# Altium schematic sheet MGNGSQ4_Extender.SchDoc
size A
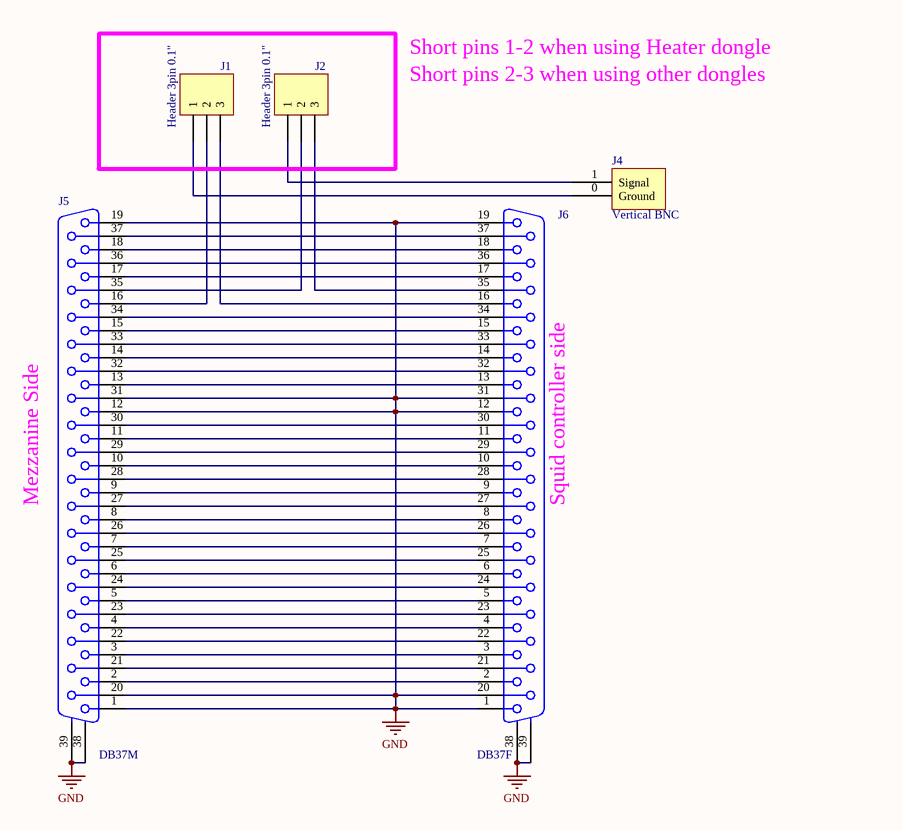
[diagram p0: MGNGSQ4_Extender.SchDoc]

## Parts
J1  Header 3pin 0.1"  [HDR1X3]
J2  Header 3pin 0.1"  [HDR1X3]
J4  Vertical BNC  [BNCVert]
J5  DB37M  [DSUB37-M]
J6  DB37F  [DSUB37-F]

## Nets
GND: J5.1 J5.12 J5.19 J5.20 J5.31 J5.38(MH1) J5.39(MH2) J6.1 J6.12 J6.19 J6.20 J6.31 J6.38(MH1) J6.39(MH2)
NetJ1_1: J1.1 J4.0(Ground)
NetJ1_2: J1.2 J5.16
NetJ1_3: J1.3 J6.16
NetJ2_1: J2.1 J4.1(Signal)
NetJ2_2: J2.2 J5.35
NetJ2_3: J2.3 J6.35
NetJ5_2: J5.2 J6.2
NetJ5_3: J5.3 J6.3
NetJ5_4: J5.4 J6.4
NetJ5_5: J5.5 J6.5
NetJ5_6: J5.6 J6.6
NetJ5_7: J5.7 J6.7
NetJ5_8: J5.8 J6.8
NetJ5_9: J5.9 J6.9
NetJ5_10: J5.10 J6.10
NetJ5_11: J5.11 J6.11
NetJ5_13: J5.13 J6.13
NetJ5_14: J5.14 J6.14
NetJ5_15: J5.15 J6.15
NetJ5_17: J5.17 J6.17
NetJ5_18: J5.18 J6.18
NetJ5_21: J5.21 J6.21
NetJ5_22: J5.22 J6.22
NetJ5_23: J5.23 J6.23
NetJ5_24: J5.24 J6.24
NetJ5_25: J5.25 J6.25
NetJ5_26: J5.26 J6.26
NetJ5_27: J5.27 J6.27
NetJ5_28: J5.28 J6.28
NetJ5_29: J5.29 J6.29
NetJ5_30: J5.30 J6.30
NetJ5_32: J5.32 J6.32
NetJ5_33: J5.33 J6.33
NetJ5_34: J5.34 J6.34
NetJ5_36: J5.36 J6.36
NetJ5_37: J5.37 J6.37

## Notes on the sheet
- Short pins 1-2 when using Heater dongle
- Short pins 2-3 when using other dongles
- (near J5) Mezzanine Side
- (near J6) Squid controller side

## Library data of the parts
J1 J2 = Header3: Header, 0.1", 3-Pin straight; Manufacturer: Digikey; Footprint: *
J4 = BNCVertical
J5 = DB37M: Assembly Comments: none; Manufacturers Part Number: DB37M; Type: Connector; SupplierUnitCost: $3.35
J6 = DB37F: Assembly Comments: none; Manufacturers Part Number: DB37F; Type: Connector; SupplierUnitCost: $3.35